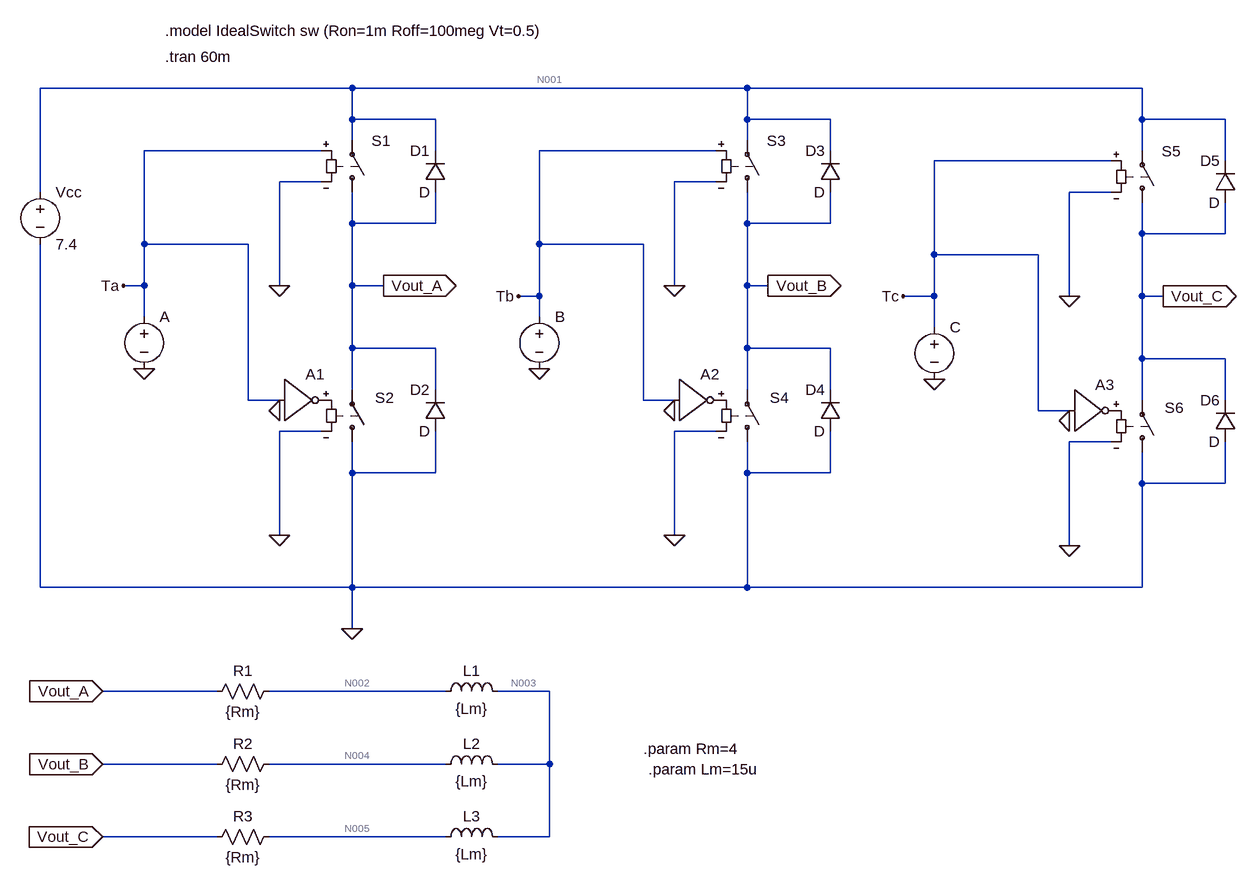
[diagram p0: schematic ServoAmplifier-SWITCH_configuration-Ideal_Switches.asc]
ServoAmplifier-SWITCH_configuration-Ideal_Switches.asc, the LTspice schematic file:
Version 4
SHEET 1 2728 1336
WIRE 512 32 32 32
WIRE 1120 32 512 32
WIRE 1728 32 1120 32
WIRE 512 80 512 32
WIRE 640 80 512 80
WIRE 1120 80 1120 32
WIRE 1248 80 1120 80
WIRE 1728 80 1728 32
WIRE 1856 80 1728 80
WIRE 512 112 512 80
WIRE 1120 112 1120 80
WIRE 464 128 192 128
WIRE 640 128 640 80
WIRE 1072 128 800 128
WIRE 1248 128 1248 80
WIRE 1728 128 1728 80
WIRE 1680 144 1408 144
WIRE 1856 144 1856 80
WIRE 464 176 400 176
WIRE 1072 176 1008 176
WIRE 32 192 32 32
WIRE 1680 192 1616 192
WIRE 512 240 512 192
WIRE 640 240 640 192
WIRE 640 240 512 240
WIRE 1120 240 1120 192
WIRE 1248 240 1248 192
WIRE 1248 240 1120 240
WIRE 1728 256 1728 208
WIRE 1856 256 1856 208
WIRE 1856 256 1728 256
WIRE 192 272 192 128
WIRE 352 272 192 272
WIRE 800 272 800 128
WIRE 960 272 800 272
WIRE 1408 288 1408 144
WIRE 1568 288 1408 288
WIRE 192 336 192 272
WIRE 192 336 160 336
WIRE 400 336 400 176
WIRE 512 336 512 240
WIRE 560 336 512 336
WIRE 1008 336 1008 176
WIRE 1120 336 1120 240
WIRE 1152 336 1120 336
WIRE 800 352 800 272
WIRE 800 352 768 352
WIRE 1408 352 1408 288
WIRE 1408 352 1360 352
WIRE 1616 352 1616 192
WIRE 1728 352 1728 256
WIRE 1760 352 1728 352
WIRE 192 384 192 336
WIRE 800 384 800 352
WIRE 1408 400 1408 352
WIRE 512 432 512 336
WIRE 640 432 512 432
WIRE 1120 432 1120 336
WIRE 1248 432 1120 432
WIRE 1728 448 1728 352
WIRE 1856 448 1728 448
WIRE 512 496 512 432
WIRE 640 496 640 432
WIRE 1120 496 1120 432
WIRE 1248 496 1248 432
WIRE 352 512 352 272
WIRE 400 512 352 512
WIRE 960 512 960 272
WIRE 1008 512 960 512
WIRE 1728 512 1728 448
WIRE 1856 512 1856 448
WIRE 1568 528 1568 288
WIRE 1616 528 1568 528
WIRE 464 560 400 560
WIRE 1072 560 1008 560
WIRE 1680 576 1616 576
WIRE 512 624 512 576
WIRE 640 624 640 560
WIRE 640 624 512 624
WIRE 1120 624 1120 576
WIRE 1248 624 1248 560
WIRE 1248 624 1120 624
WIRE 1728 640 1728 592
WIRE 1856 640 1856 576
WIRE 1856 640 1728 640
WIRE 400 720 400 560
WIRE 1008 720 1008 560
WIRE 1616 736 1616 576
WIRE 32 800 32 272
WIRE 512 800 512 624
WIRE 512 800 32 800
WIRE 1120 800 1120 624
WIRE 1120 800 512 800
WIRE 1728 800 1728 640
WIRE 1728 800 1120 800
WIRE 512 864 512 800
WIRE 304 960 128 960
WIRE 656 960 384 960
WIRE 816 960 736 960
WIRE 304 1072 128 1072
WIRE 656 1072 384 1072
WIRE 816 1072 816 960
WIRE 816 1072 736 1072
WIRE 304 1184 128 1184
WIRE 656 1184 384 1184
WIRE 816 1184 816 1072
WIRE 816 1184 736 1184
FLAG 512 864 0
FLAG 192 464 0
FLAG 400 336 0
FLAG 400 720 0
FLAG 400 528 0
FLAG 800 464 0
FLAG 1008 336 0
FLAG 1008 720 0
FLAG 1008 528 0
FLAG 1408 480 0
FLAG 1616 352 0
FLAG 1616 736 0
FLAG 1616 544 0
FLAG 560 336 Vout_A
IOPIN 560 336 Out
FLAG 128 960 Vout_A
IOPIN 128 960 In
FLAG 1152 336 Vout_B
IOPIN 1152 336 Out
FLAG 128 1072 Vout_B
IOPIN 128 1072 In
FLAG 1760 352 Vout_C
IOPIN 1760 352 Out
FLAG 128 1184 Vout_C
IOPIN 128 1184 In
FLAG 160 336 Ta
FLAG 768 352 Tb
FLAG 1360 352 Tc
SYMBOL voltage 32 176 R0
WINDOW 123 0 0 Left 0
WINDOW 39 24 124 Left 2
SYMATTR InstName Vcc
SYMATTR Value 7.4
SYMBOL voltage 192 368 R0
WINDOW 3 -97 137 Invisible 2
SYMATTR Value PWL REPEAT FOREVER (0 1 4m 1 7m999 1 8m 0 12m 0 16m 0 19m999 0 20m 1 24m 1) ENDREPEAT
SYMATTR InstName A
SYMBOL sw 512 208 M180
WINDOW 0 30 95 Left 2
WINDOW 3 24 96 Invisible 2
SYMATTR InstName S1
SYMATTR Value IdealSwitch
SYMBOL diode 656 192 R180
WINDOW 0 24 64 Left 2
WINDOW 3 24 0 Left 2
SYMATTR InstName D1
SYMBOL Digital\\inv 400 448 R0
SYMATTR InstName A1
SYMBOL sw 512 592 M180
WINDOW 0 35 84 Left 2
WINDOW 3 24 96 Invisible 2
SYMATTR InstName S2
SYMATTR Value IdealSwitch
SYMBOL diode 656 560 R180
WINDOW 0 24 64 Left 2
WINDOW 3 24 0 Left 2
SYMATTR InstName D2
SYMBOL sw 1120 208 M180
WINDOW 0 30 95 Left 2
WINDOW 3 24 96 Invisible 2
SYMATTR InstName S3
SYMATTR Value IdealSwitch
SYMBOL diode 1264 192 R180
WINDOW 0 24 64 Left 2
WINDOW 3 24 0 Left 2
SYMATTR InstName D3
SYMBOL sw 1120 592 M180
WINDOW 0 35 84 Left 2
WINDOW 3 24 96 Invisible 2
SYMATTR InstName S4
SYMATTR Value IdealSwitch
SYMBOL diode 1264 560 R180
WINDOW 0 24 64 Left 2
WINDOW 3 24 0 Left 2
SYMATTR InstName D4
SYMBOL voltage 800 368 R0
WINDOW 3 24 44 Invisible 2
SYMATTR Value PWL REPEAT FOREVER (0 0 3m999 0 4m 1 8m 1 12m 1 15m999 1 16m 0 20m 0 24m 0) ENDREPEAT
SYMATTR InstName B
SYMBOL Digital\\inv 1008 448 R0
SYMATTR InstName A2
SYMBOL sw 1728 224 M180
WINDOW 0 30 95 Left 2
WINDOW 3 24 96 Invisible 2
SYMATTR InstName S5
SYMATTR Value IdealSwitch
SYMBOL diode 1872 208 R180
WINDOW 0 24 64 Left 2
WINDOW 3 24 0 Left 2
SYMATTR InstName D5
SYMBOL sw 1728 608 M180
WINDOW 0 35 84 Left 2
WINDOW 3 24 96 Invisible 2
SYMATTR InstName S6
SYMATTR Value IdealSwitch
SYMBOL diode 1872 576 R180
WINDOW 0 24 64 Left 2
WINDOW 3 24 0 Left 2
SYMATTR InstName D6
SYMBOL voltage 1408 384 R0
WINDOW 3 -97 137 Invisible 2
SYMATTR Value PWL REPEAT FOREVER (0 0 4m 0 8m 0 11m999 0 12m 1 16m 1 20m 1 23m999 1 24m 0) ENDREPEAT
SYMATTR InstName C
SYMBOL Digital\\inv 1616 464 R0
SYMATTR InstName A3
SYMBOL ind 640 976 R270
WINDOW 0 32 56 VTop 2
WINDOW 3 5 56 VBottom 2
SYMATTR InstName L1
SYMATTR Value {Lm}
SYMBOL ind 640 1088 R270
WINDOW 0 32 56 VTop 2
WINDOW 3 5 56 VBottom 2
SYMATTR InstName L2
SYMATTR Value {Lm}
SYMBOL ind 640 1200 R270
WINDOW 0 32 56 VTop 2
WINDOW 3 5 56 VBottom 2
SYMATTR InstName L3
SYMATTR Value {Lm}
SYMBOL res 400 944 R90
WINDOW 0 0 56 VBottom 2
WINDOW 3 32 56 VTop 2
SYMATTR InstName R1
SYMATTR Value {Rm}
SYMBOL res 400 1056 R90
WINDOW 0 0 56 VBottom 2
WINDOW 3 32 56 VTop 2
SYMATTR InstName R2
SYMATTR Value {Rm}
SYMBOL res 400 1168 R90
WINDOW 0 0 56 VBottom 2
WINDOW 3 32 56 VTop 2
SYMATTR InstName R3
SYMATTR Value {Rm}
TEXT 224 -16 Left 2 !.tran 60m
TEXT 224 -56 Left 2 !.model IdealSwitch sw (Ron=1m Roff=100meg Vt=0.5)
TEXT 960 1048 Left 2 !.param Rm=4
TEXT 968 1080 Left 2 !.param Lm=15u

The netlist it stands for:
* ServoAmplifier-SWITCH_configuration-Ideal_Switches.asc
Vcc N001 0 7.4
V§A Ta 0 PWL REPEAT FOREVER (0 1 4m 1 7m999 1 8m 0 12m 0 16m 0 19m999 0 20m 1 24m 1) ENDREPEAT
S1 Vout_A N001 Ta 0 IdealSwitch
D1 Vout_A N001 D
A1 Ta 0 0 0 0 P001 0 0 BUF
S2 0 Vout_A P001 0 IdealSwitch
D2 0 Vout_A D
S3 Vout_B N001 Tb 0 IdealSwitch
D3 Vout_B N001 D
S4 0 Vout_B P002 0 IdealSwitch
D4 0 Vout_B D
V§B Tb 0 PWL REPEAT FOREVER (0 0 3m999 0 4m 1 8m 1 12m 1 15m999 1 16m 0 20m 0 24m 0) ENDREPEAT
A2 Tb 0 0 0 0 P002 0 0 BUF
S5 Vout_C N001 Tc 0 IdealSwitch
D5 Vout_C N001 D
S6 0 Vout_C P003 0 IdealSwitch
D6 0 Vout_C D
V§C Tc 0 PWL REPEAT FOREVER (0 0 4m 0 8m 0 11m999 0 12m 1 16m 1 20m 1 23m999 1 24m 0) ENDREPEAT
A3 Tc 0 0 0 0 P003 0 0 BUF
L1 N002 N003 {Lm}
L2 N004 N003 {Lm}
L3 N005 N003 {Lm}
R1 N002 Vout_A {Rm}
R2 N004 Vout_B {Rm}
R3 N005 Vout_C {Rm}
.model D D
.lib standard.dio
.tran 60m
.model IdealSwitch sw (Ron=1m Roff=100meg Vt=0.5)
.param Rm=4
.param Lm=15u
.backanno
.end

* Results of the author's LTspice run, read from the files saved beside the schematic
* Operating Point, zero values left out:
*   V(n001) = 7.4 V
*   V(ta) = 1 V
*   V(vout_a) = 7.399 V
*   V(vout_b) = 616.4 µV
*   V(p002) = 1 V
*   V(vout_c) = 616.4 µV
*   V(p003) = 1 V
*   V(n002) = 2.468 V
*   V(n003) = 2.467 V
*   V(n004) = 2.466 V
*   V(n005) = 2.466 V
*   I(D2) = -7.409 pA
*   I(D3) = -7.409 pA
*   I(D5) = -7.409 pA
*   I(L1) = 1.233 A
*   I(L2) = -616.4 mA
*   I(L3) = -616.4 mA
*   I(R1) = -1.233 A
*   I(R2) = 616.4 mA
*   I(R3) = 616.4 mA
*   I(S1) = 1.233 A
*   I(S2) = 74 nA
*   I(S3) = 74 nA
*   I(S4) = 616.4 mA
*   I(S5) = 74 nA
*   I(S6) = 616.4 mA
*   I(Vcc) = -1.233 A
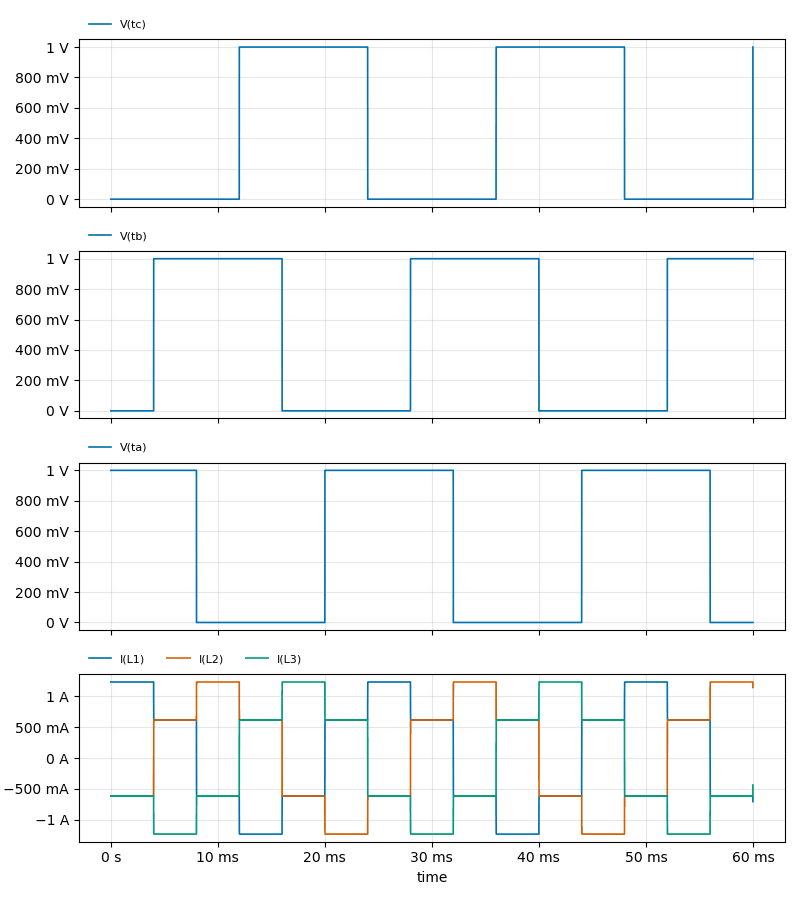
[diagram p1: Transient Analysis of ServoAmplifier-SWITCH_configuration-Ideal_Switches.asc, plotted from the saved traces]
* Transient Analysis, 1 run:
*   V(tc): min 0 V, max 1 V, average 400 mV, rms 632.5 mV, last 1 V
*   V(tb): min 0 V, max 1 V, average 533.3 mV, rms 730.3 mV, last 1 V
*   V(ta): min 0 V, max 1 V, average 533.3 mV, rms 730.3 mV, last 0 V
*   I(L1): min -1.233 A, max 1.233 A, average 82.29 mA, rms 871.5 mA, last -705.7 mA
*   I(L2): min -1.233 A, max 1.233 A, average 82.07 mA, rms 871.4 mA, last 1.143 A
*   I(L3): min -1.233 A, max 1.233 A, average -164.4 mA, rms 871.5 mA, last -437.7 mA